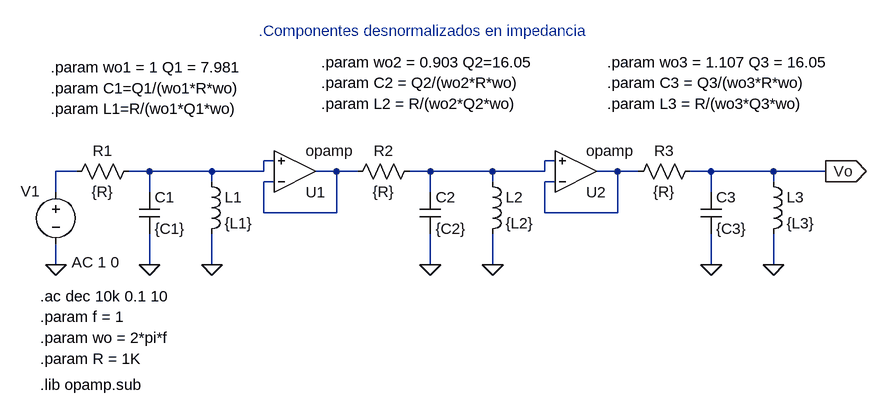
[diagram p0: schematic TS4bis2_pasivo.asc]
TS4bis2_pasivo.asc, the LTspice schematic file:
Version 4
SHEET 1 1204 680
WIRE 240 80 224 80
WIRE 672 80 656 80
WIRE -64 96 -96 96
WIRE 48 96 16 96
WIRE 144 96 48 96
WIRE 224 96 224 80
WIRE 224 96 144 96
WIRE 336 96 304 96
WIRE 368 96 336 96
WIRE 480 96 448 96
WIRE 576 96 480 96
WIRE 656 96 656 80
WIRE 656 96 576 96
WIRE 768 96 736 96
WIRE 800 96 768 96
WIRE 912 96 880 96
WIRE 1008 96 912 96
WIRE 1088 96 1008 96
WIRE 144 112 144 96
WIRE 240 112 224 112
WIRE 576 112 576 96
WIRE 672 112 656 112
WIRE 1008 112 1008 96
WIRE -96 128 -96 96
WIRE 48 128 48 96
WIRE 480 128 480 96
WIRE 912 128 912 96
WIRE 224 160 224 112
WIRE 336 160 336 96
WIRE 336 160 224 160
WIRE 656 160 656 112
WIRE 768 160 768 96
WIRE 768 160 656 160
WIRE -96 240 -96 208
WIRE 48 240 48 192
WIRE 144 240 144 192
WIRE 480 240 480 192
WIRE 576 240 576 192
WIRE 912 240 912 192
WIRE 1008 240 1008 192
FLAG 1088 96 Vo
IOPIN 1088 96 Out
FLAG 912 240 0
FLAG 1008 240 0
FLAG 576 240 0
FLAG 480 240 0
FLAG 144 240 0
FLAG 48 240 0
FLAG -96 240 0
SYMBOL res 32 80 R90
WINDOW 0 0 56 VBottom 2
WINDOW 3 32 56 VTop 2
SYMATTR InstName R1
SYMATTR Value {R}
SYMBOL cap 32 128 R0
SYMATTR InstName C1
SYMATTR Value {C1}
SYMBOL ind 128 96 R0
SYMATTR InstName L1
SYMATTR Value {L1}
SYMBOL OpAmps\\opamp 272 160 M180
SYMATTR InstName U1
SYMBOL res 464 80 R90
WINDOW 0 0 56 VBottom 2
WINDOW 3 32 56 VTop 2
SYMATTR InstName R2
SYMATTR Value {R}
SYMBOL cap 464 128 R0
SYMATTR InstName C2
SYMATTR Value {C2}
SYMBOL ind 560 96 R0
SYMATTR InstName L2
SYMATTR Value {L2}
SYMBOL OpAmps\\opamp 704 160 M180
SYMATTR InstName U2
SYMBOL res 896 80 R90
WINDOW 0 0 56 VBottom 2
WINDOW 3 32 56 VTop 2
SYMATTR InstName R3
SYMATTR Value {R}
SYMBOL cap 896 128 R0
SYMATTR InstName C3
SYMATTR Value {C3}
SYMBOL ind 992 96 R0
SYMATTR InstName L3
SYMATTR Value {L3}
SYMBOL voltage -96 112 R0
WINDOW 0 -54 15 Left 2
WINDOW 123 24 124 Left 2
WINDOW 39 0 0 Left 0
SYMATTR InstName V1
SYMATTR Value2 AC 1 0
SYMATTR Value ""
TEXT -120 424 Left 2 !.lib opamp.sub
TEXT -120 384 Left 2 !.param R = 1K
TEXT -120 320 Left 2 !.param f = 1
TEXT -104 -64 Left 2 !.param wo1 = 1 Q1 = 7.981
TEXT -104 -32 Left 2 !.param C1=Q1/(wo1*R*wo)
TEXT 312 -72 Left 2 !.param wo2 = 0.903 Q2=16.05
TEXT 312 -40 Left 2 !.param C2 = Q2/(wo2*R*wo)
TEXT -104 0 Left 2 !.param L1=R/(wo1*Q1*wo)
TEXT 312 -8 Left 2 !.param L2 = R/(wo2*Q2*wo)
TEXT 752 -72 Left 2 !.param wo3 = 1.107 Q3 = 16.05
TEXT 752 -40 Left 2 !.param C3 = Q3/(wo3*R*wo)
TEXT 752 -8 Left 2 !.param L3 = R/(wo3*Q3*wo)
TEXT -120 288 Left 2 !.ac dec 10k 0.1 10
TEXT -120 352 Left 2 !.param wo = 2*pi*f
TEXT 216 -120 Left 2 ;.Componentes desnormalizados en impedancia

The netlist it stands for:
* TS4bis2_pasivo.asc
R1 N001 N003 {R}
C1 N001 0 {C1}
L1 N001 0 {L1}
XU1 N004 N001 N004 opamp Aol=100K GBW=10Meg  ; pins invin noninvin out
R2 N002 N004 {R}
C2 N002 0 {C2}
L2 N002 0 {L2}
XU2 N005 N002 N005 opamp Aol=100K GBW=10Meg  ; pins invin noninvin out
R3 Vo N005 {R}
C3 Vo 0 {C3}
L3 Vo 0 {L3}
V1 N003 0 AC 1 0
.lib opamp.sub
.param R = 1K
.param f = 1
.param wo1 = 1 Q1 = 7.981
.param C1=Q1/(wo1*R*wo)
.param wo2 = 0.903 Q2=16.05
.param C2 = Q2/(wo2*R*wo)
.param L1=R/(wo1*Q1*wo)
.param L2 = R/(wo2*Q2*wo)
.param wo3 = 1.107 Q3 = 16.05
.param C3 = Q3/(wo3*R*wo)
.param L3 = R/(wo3*Q3*wo)
.ac dec 10k 0.1 10
.param wo = 2*pi*f
* .Componentes desnormalizados en impedancia
.backanno
.end